# Altium schematic sheet 0 revision history.SchDoc
size A4; DocumentNumber: 0; SheetNumber: 1; SheetTotal: 9
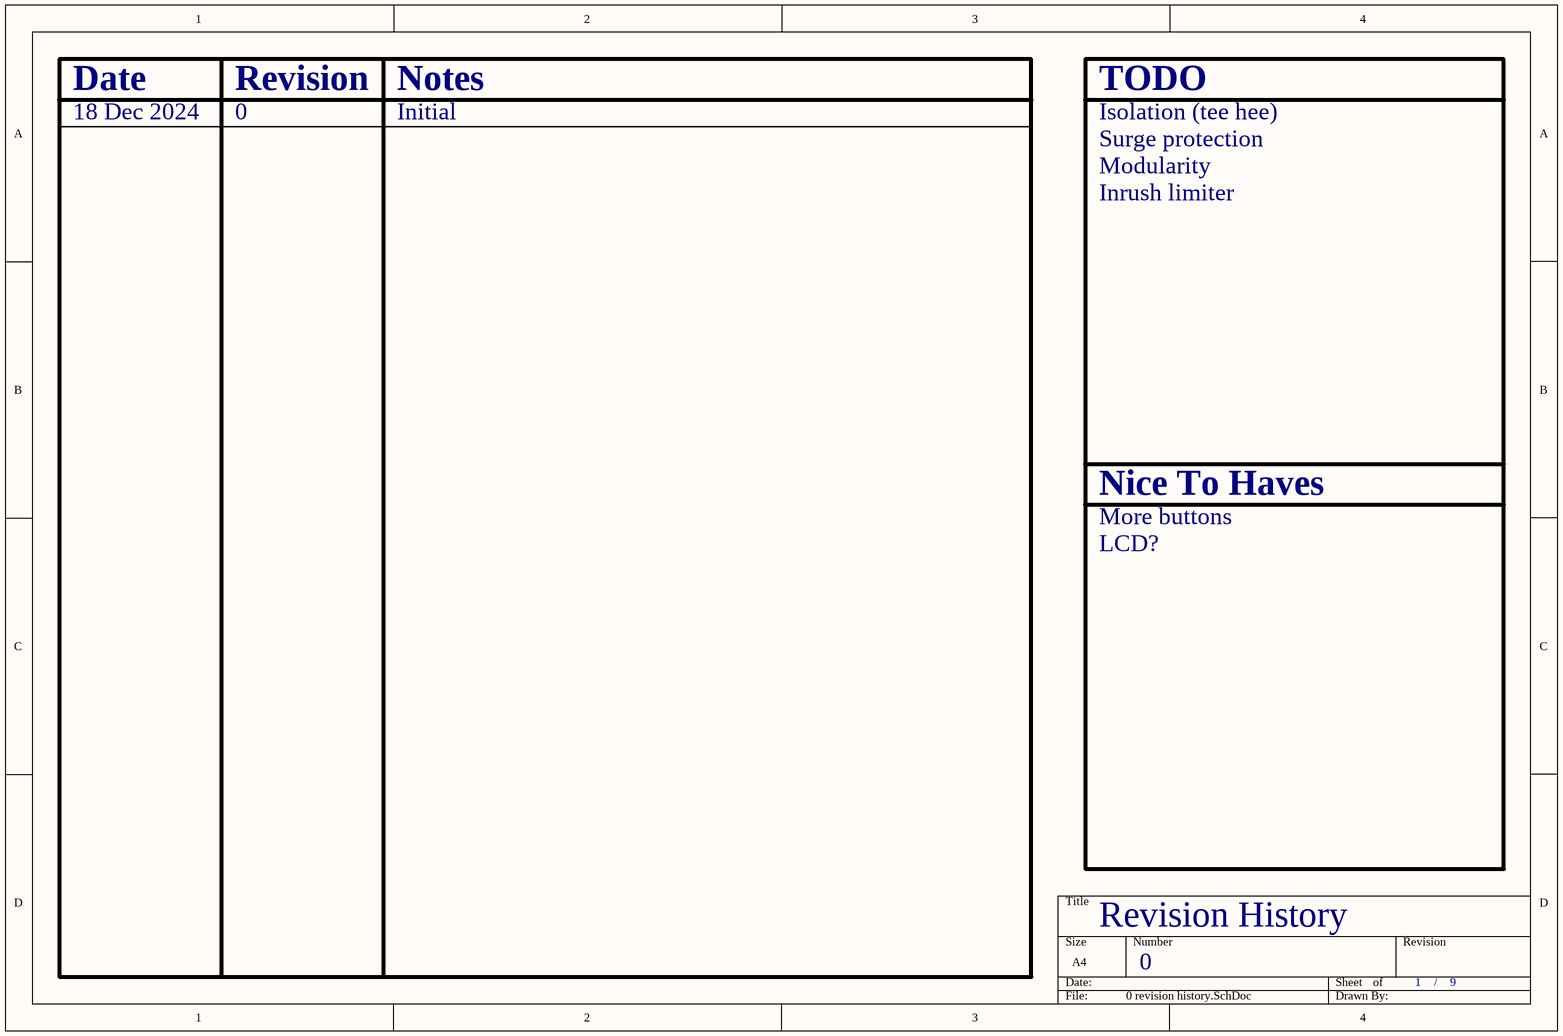
[diagram p0: 0 revision history.SchDoc]

## Notes on the sheet
- Date
- Revision
- Notes
- TODO
- 18 Dec 2024
- 0
- Initial
- Isolation (tee hee)
- Surge protection
- Modularity
- Inrush limiter
- Nice To Haves
- More buttons
- LCD?
- Revision History
- /